# Altium schematic sheet 02b3_USB_UART_BRIDGE.SchDoc
size 314 x 223 mm; SheetNumber: 3
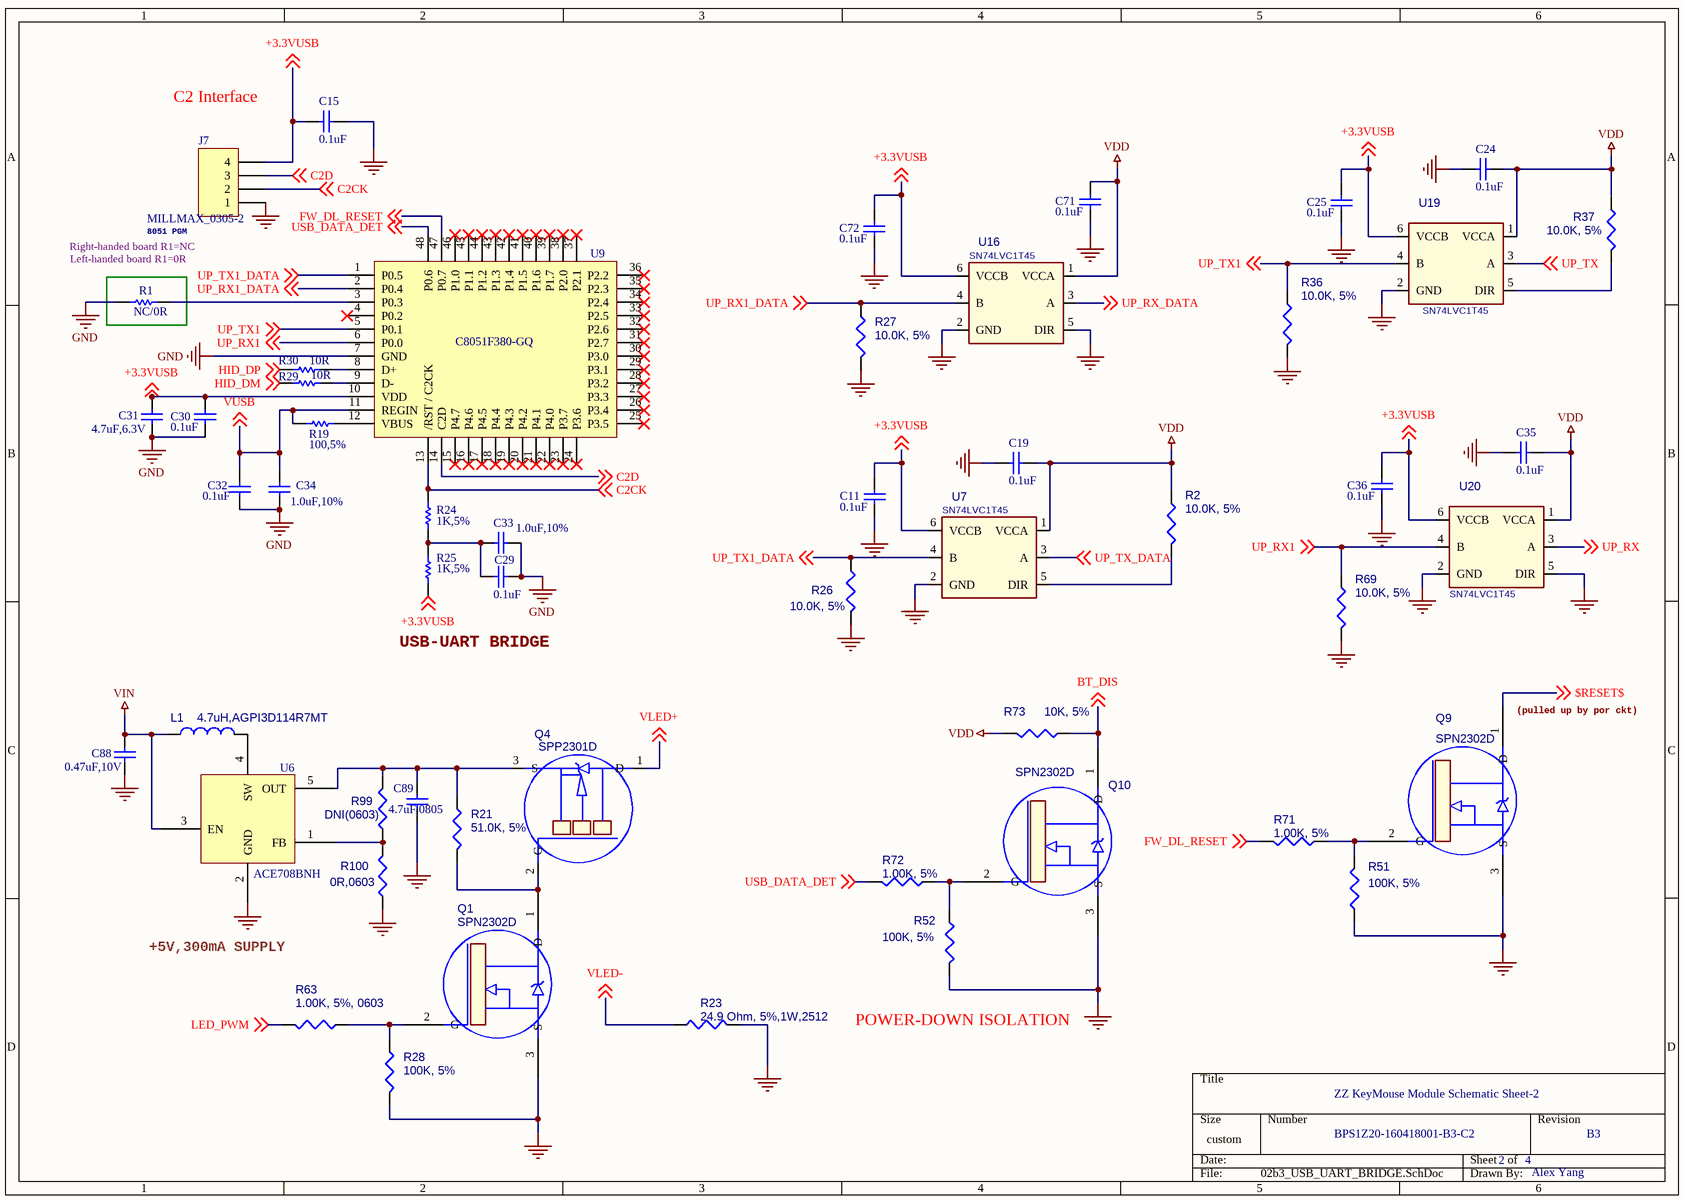
[diagram p0: 02b3_USB_UART_BRIDGE.SchDoc]

## Parts
C11  0.1uF  [0603]
C15  0.1uF  [0603]
C19  0.1uF  [0603]
C24  0.1uF  [0603]
C25  0.1uF  [0603]
C29  0.1uF  [0603]
C30  0.1uF  [0603]
C31  4.7uF,6.3V  [0603]
C32  0.1uF  [0603]
C33  1.0uF,10%  [0603]
C34  1.0uF,10%  [0603]
C35  0.1uF  [0603]
C36  0.1uF  [0603]
C71  0.1uF  [0603]
C72  0.1uF  [0603]
C88  0.47uF,10V  [0603]
C89  4.7uF,0805  [0805]
J7  MILLMAX_0305-2  [MILLMAX_0305-2_4-POS]
L1  4.7uH,AGPI3D114R7MT  [AGPI13D114R7MT]
Q1  SPN2302D  [SOT23]
Q4  SPP2301D  [SOT23]
Q9  SPN2302D  [SOT23]
Q10  SPN2302D  [SOT23]
R1  NC/0R  [0402]
R2  10.0K, 5%  [0402]
R19  100,5%  [0402]
R21  51.0K, 5%  [0402]
R23  24.9 Ohm, 5%,1W,2512  [RESC6432X70]
R24  1K,5%  [0402]
R25  1K,5%  [0402]
R26  10.0K, 5%  [0402]
R27  10.0K, 5%  [0402]
R28  100K, 5%  [0402]
R29  10R  [0402]
R30  10R  [0402]
R36  10.0K, 5%  [0402]
R37  10.0K, 5%  [0402]
R51  100K, 5%  [0402]
R52  100K, 5%  [0402]
R63  1.00K, 5%, 0603  [0402]
R69  10.0K, 5%  [0402]
R71  1.00K, 5%  [0402]
R72  1.00K, 5%  [0402]
R73  10K, 5%  [0402]
R99  DNI(0603)  [0402]
R100  0R,0603  [0402]
U6  ACE708BNH  [SOT23-5]
U7  SN74LVC1T45  [SOT23-6]
U9  C8051F380-GQ  [TQFP48]
U16  SN74LVC1T45  [SOT23-6]
U19  SN74LVC1T45  [SOT23-6]
U20  SN74LVC1T45  [SOT23-6]

## Nets
GND: C11.2 C15.1 C19.1 C24.1 C25.2 C29.1 C30.2 C31.1 C32.2 C33.1 C34.1 C35.1 C36.2 C71.2 C72.2 C88.1 C89.1 J7.1 Q1.3(S) Q9.3(S) Q10.3(S) R1.1 R23.2 R26.2 R27.2 R28.1 R36.2 R51.1 R52.1 R69.2 R100.2 U6.2(GND) U7.2(GND) U9.7(GND) U16.2(GND) U16.5(DIR) U19.2(GND) U20.2(GND) U20.5(DIR)
VDD: C19.2 C24.2 C35.2 C71.1 R2.1 R37.1 R73.1 U7.1(VCCA) U16.1(VCCA) U19.1(VCCA) U20.1(VCCA)
VIN: C88.2 L1.1 U6.3(EN)
$RESET$: Q9.1(D) ; off-sheet $RESET$
+3.3VUSB: C11.1 C15.2 C25.1 C30.1 C31.2 C36.1 C72.1 J7.4 R25.1 U7.6(VCCB) U9.10(VDD) U16.6(VCCB) U19.6(VCCB) U20.6(VCCB) ; off-sheet +3.3VUSB
BT_DIS: Q10.1(D) R73.2 ; off-sheet BT_DIS
C2CK: J7.2 R24.2 U9.13(/RST_/_C2CK) ; off-sheet C2CK
C2D: J7.3 U9.14(C2D) ; off-sheet C2D
FW_DL_RESET: R71.1 U9.47(P0.7) ; off-sheet FW_DL_RESET
HID_DM: R29.1 ; off-sheet HID_DM
HID_DP: R30.1 ; off-sheet HID_DP
LED_PWM: R63.1 ; off-sheet LED_PWM
UP_RX: U20.3(A) ; off-sheet UP_RX
UP_RX1: R69.1 U9.6(P0.0) U20.4(B) ; off-sheet UP_RX1
UP_RX1_DATA: R27.1 U9.2(P0.4) U16.4(B) ; off-sheet UP_RX1_DATA
UP_RX_DATA: U16.3(A) ; off-sheet UP_RX_DATA
UP_TX: U19.3(A) ; off-sheet UP_TX
UP_TX1: R36.1 U9.5(P0.1) U19.4(B) ; off-sheet UP_TX1
UP_TX1_DATA: R26.1 U7.4(B) U9.1(P0.5) ; off-sheet UP_TX1_DATA
UP_TX_DATA: U7.3(A) ; off-sheet UP_TX_DATA
USB_DATA_DET: R72.1 U9.48(P0.6) ; off-sheet USB_DATA_DET
VLED+: Q4.1(D) ; off-sheet VLED+
VLED-: R23.1 ; off-sheet VLED-
VUSB: C32.1 C34.2 R19.1 U9.11(REGIN) ; off-sheet VUSB
NetC29_2: C29.2 C33.2 R24.1 R25.2
NetC89_2: C89.2 Q4.3(S) R21.1 R99.1 U6.5(OUT)
NetL1_2: L1.2 U6.4(SW)
NetQ1_1: Q1.1(D) Q4.2(G) R21.2
NetQ1_2: Q1.2(G) R28.2 R63.2
NetQ9_2: Q9.2(G) R51.2 R71.2
NetQ10_2: Q10.2(G) R52.2 R72.2
NetR1_2: R1.2 U9.3(P0.3)
NetR2_2: R2.2 U7.5(DIR)
NetR19_2: R19.2 U9.12(VBUS)
NetR29_2: R29.2 U9.9(D-)
NetR30_2: R30.2 U9.8(D+)
NetR37_2: R37.2 U19.5(DIR)
NetR99_2: R99.2 R100.1 U6.1(FB)

Not connected (* = marked no-connect by the designer): U9 4(P0.2)* 15(P4.7)* 16(P4.6)* 17(P4.5)* 18(P4.4)* 19(P4.3)* 20(P4.2)* 21(P4.1)* 22(P4.0)* 23(P3.7)* 24(P3.6)* 25(P3.5)* 26(P3.4)* 27(P3.3)* 28(P3.2)* 29(P3.1)* 30(P3.0)* 31(P2.7)* 32(P2.6)* 33(P2.5)* 34(P2.4)* 35(P2.3)* 36(P2.2)* 37(P2.1)* 38(P2.0)* 39(P1.7)* 40(P1.6)* 41(P1.5)* 42(P1.4)* 43(P1.3)* 44(P1.2)* 45(P1.1)* 46(P1.0)*

## Notes on the sheet
- C2 Interface
- Right-handed board R1=NC
- (near R1) Left-handed board R1=0R
- 8051 PGM
- USB-UART BRIDGE
- (near Q9) (pulled up by por ckt)
- +5V,300mA SUPPLY
- (near R52) POWER-DOWN ISOLATION
- ZZ KeyMouse Module Schematic Sheet-2
- BPS1Z20-160418001-B3-C2
- B3
- 2
- 4
- Alex Yang

## Library data of the parts
C11 C15 C19 C24 C25 C29-C36 C71 C72 C88 C89 = Cap: Capacitor
J7 = Header 4: Header, 4-Pin; LatestRevisionDate: 17-Jul-2002; LatestRevisionNote: Re-released for DXP Platform.; Publisher: Altium Limited
L1 = INDUCTOR
Q1 Q9 Q10 = AO3416
Q4 = AO3435
R1 R19 R29 R30 = Res1: Resistor; Value: 1K; Published: 8-Jun-2000; LatestRevisionDate: 17-Jul-2002; LatestRevisionNote: Re-released for DXP Platform.; PackageReference: AXIAL-0.3; Publisher: Altium Limited
R2 R21 R23 R26-R28 R36 R37 R51 R52 R63 R69 R71-R73 R99 R100 = R
R24 R25 = Res1: Resistor; Published: 8-Jun-2000; LatestRevisionDate: 17-Jul-2002; LatestRevisionNote: Re-released for DXP Platform.; PackageReference: AXIAL-0.3; Publisher: Altium Limited; Value: 1K
U6 = ACE708BNH: Value: 100pF; Published: 8-Jun-2000; LatestRevisionDate: 17-Jul-2002; LatestRevisionNote: Re-released for DXP Platform.; PackageReference: RAD-0.3; Publisher: Altium Limited